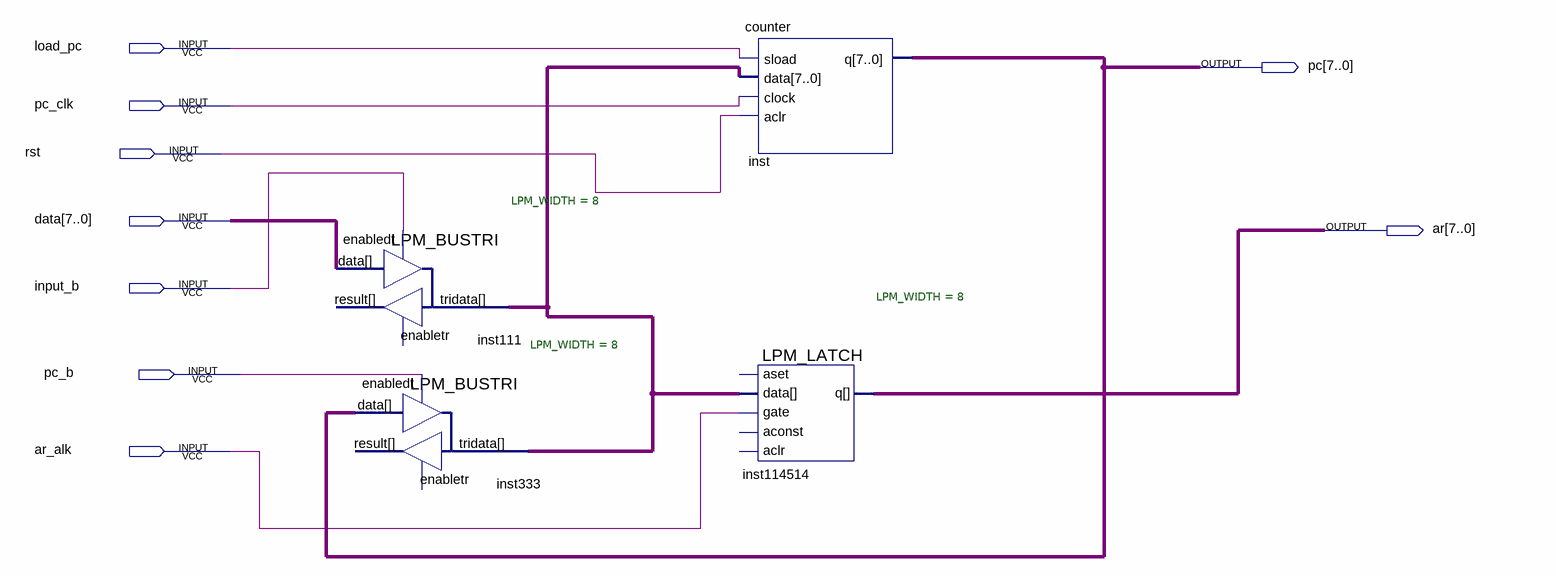
[diagram p0: schematic sheet]
// Quartus schematic AR.bdf as structural Verilog: 4 symbols, 9 pins
module AR (
  input  load_pc,
  input  pc_clk,
  input  rst,
  input  [7:0] data,
  input  input_b,
  input  pc_b,
  input  ar_alk,
  output [7:0] pc,
  output [7:0] ar
);

  wire [7:0] inst111_tridata;

  LPM_BUSTRI #(.LPM_WIDTH(8)) inst111 (
    .data(data), .enabledt(input_b), .tridata(inst111_tridata));  // open: enabletr, result
  LPM_BUSTRI #(.LPM_WIDTH(8)) inst333 (
    .data(pc), .enabledt(pc_b), .tridata(inst111_tridata));  // open: enabletr, result
  counter inst (.sload(load_pc), .data(inst111_tridata), .clock(pc_clk), .aclr(rst), .q(pc));
  LPM_LATCH #(.LPM_WIDTH(8)) inst114514 (.data(inst111_tridata), .gate(ar_alk), .q(ar));  // open: aset, aconst, aclr
endmodule
